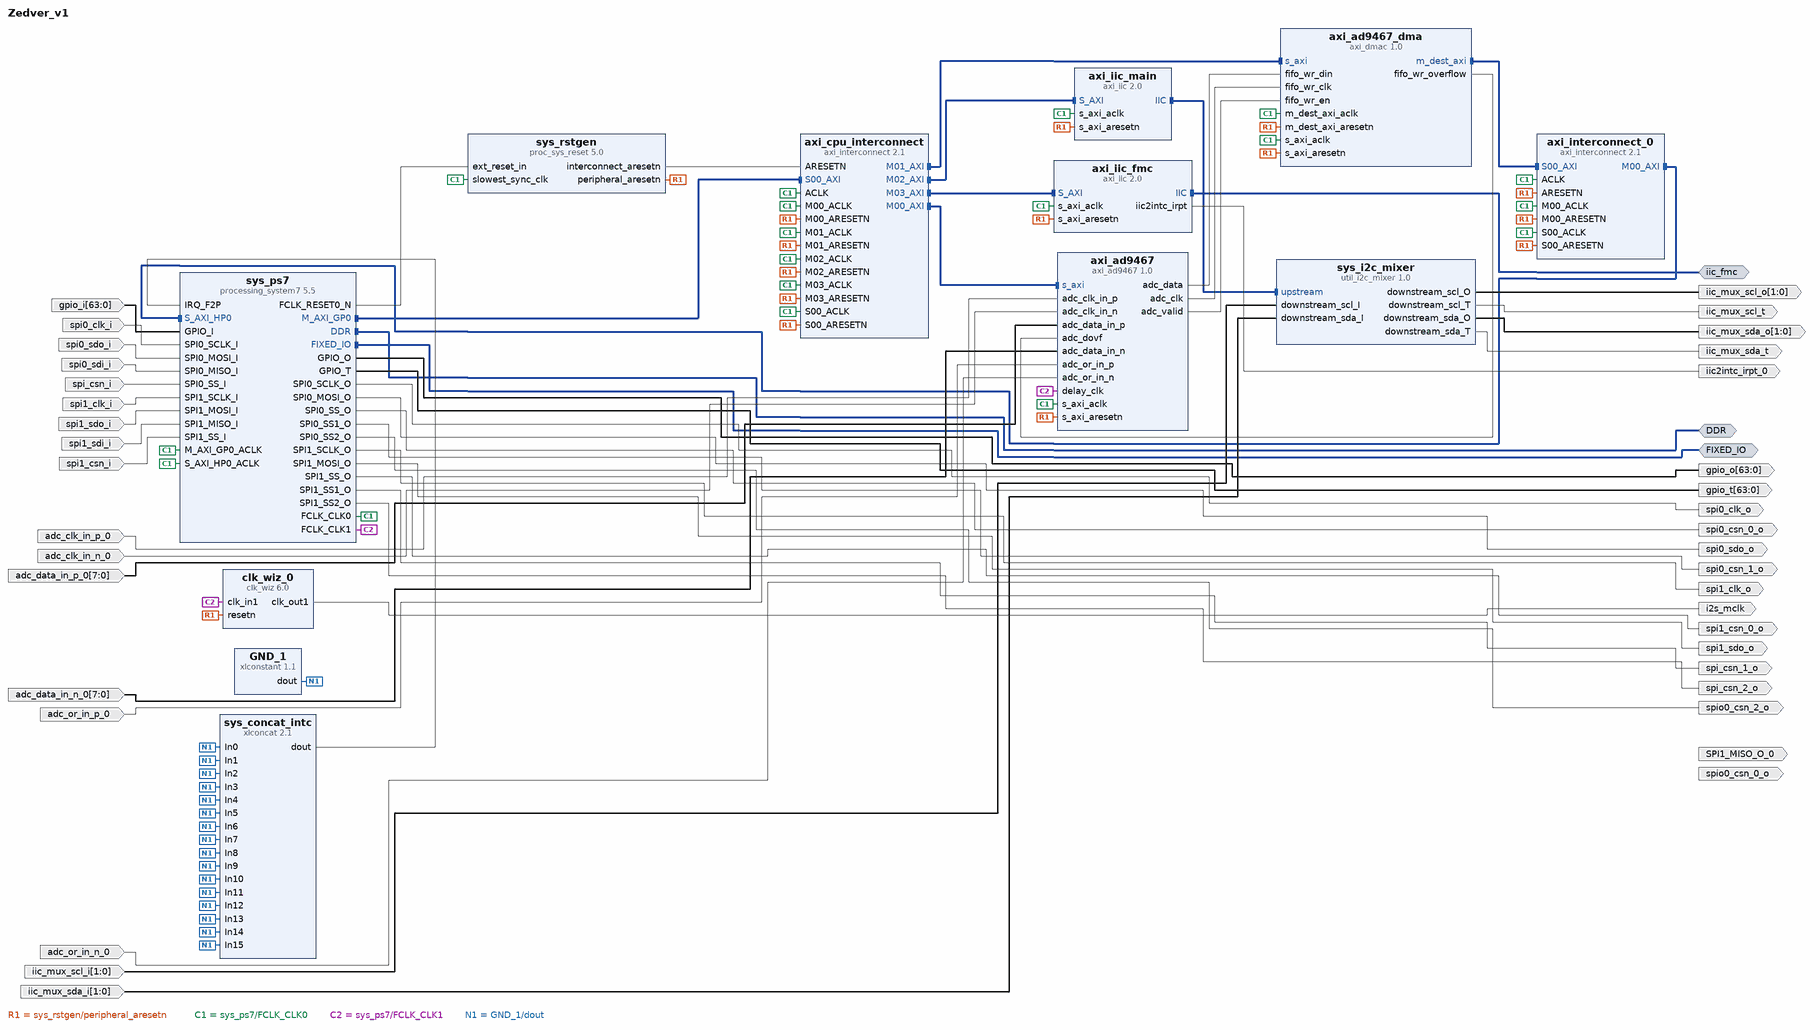
[diagram p0: block diagram of the top level]
# Vivado block design Zedver_v1, xc7z020clg484-1, Vivado 2018.2
create_bd_design Zedver_v1

create_bd_intf_port -mode Master -vlnv xilinx.com:interface:ddrx_rtl:1.0 DDR
create_bd_intf_port -mode Master -vlnv xilinx.com:display_processing_system7:fixedio_rtl:1.0 FIXED_IO
create_bd_intf_port -mode Master -vlnv xilinx.com:interface:iic_rtl:1.0 iic_fmc
create_bd_port -dir O spio0_csn_0_o
create_bd_port -dir O SPI1_MISO_O_0
create_bd_port -dir I -from 63 -to 0 gpio_i
create_bd_port -dir O -from 63 -to 0 gpio_o
create_bd_port -dir O -from 63 -to 0 gpio_t
create_bd_port -dir I spi0_clk_i
create_bd_port -dir O spi0_clk_o
create_bd_port -dir I spi0_sdo_i
create_bd_port -dir O spi0_sdo_o
create_bd_port -dir I spi0_sdi_i
create_bd_port -dir I spi_csn_i
create_bd_port -dir O spi0_csn_0_o
create_bd_port -dir O spi0_csn_1_o
create_bd_port -dir O spio0_csn_2_o
create_bd_port -dir I spi1_clk_i
create_bd_port -dir O spi1_clk_o
create_bd_port -dir I spi1_sdo_i
create_bd_port -dir O spi1_sdo_o
create_bd_port -dir I spi1_sdi_i
create_bd_port -dir I spi1_csn_i
create_bd_port -dir O spi1_csn_0_o
create_bd_port -dir O spi_csn_1_o
create_bd_port -dir O spi_csn_2_o
create_bd_port -dir I -type clk adc_clk_in_p_0
create_bd_port -dir I -type clk adc_clk_in_n_0
create_bd_port -dir I -from 7 -to 0 adc_data_in_p_0
create_bd_port -dir I -from 7 -to 0 adc_data_in_n_0
create_bd_port -dir I adc_or_in_p_0
create_bd_port -dir I adc_or_in_n_0
create_bd_port -dir O -type clk i2s_mclk
create_bd_port -dir I -from 1 -to 0 iic_mux_scl_i
create_bd_port -dir O -from 1 -to 0 iic_mux_scl_o
create_bd_port -dir O iic_mux_scl_t
create_bd_port -dir I -from 1 -to 0 iic_mux_sda_i
create_bd_port -dir O -from 1 -to 0 iic_mux_sda_o
create_bd_port -dir O iic_mux_sda_t
create_bd_port -dir O -type intr iic2intc_irpt_0

create_bd_cell -type ip -vlnv analog.com:user:axi_ad9467:1.0 axi_ad9467
create_bd_cell -type ip -vlnv analog.com:user:axi_dmac:1.0 axi_ad9467_dma
set_property -dict {CONFIG.DMA_DATA_WIDTH_SRC 16 CONFIG.DMA_AXI_PROTOCOL_DEST 1} [get_bd_cells axi_ad9467_dma]
create_bd_cell -type ip -vlnv xilinx.com:ip:processing_system7:5.5 sys_ps7
set_property -dict [list \
  CONFIG.PCW_FCLK_CLK1_BUF TRUE \
  CONFIG.PCW_UIPARAM_DDR_FREQ_MHZ 533.333313 \
  CONFIG.PCW_APU_PERIPHERAL_FREQMHZ 666.666667 \
  CONFIG.PCW_SDIO_PERIPHERAL_FREQMHZ 50 \
  CONFIG.PCW_UART_PERIPHERAL_FREQMHZ 50 \
  CONFIG.PCW_FPGA0_PERIPHERAL_FREQMHZ 100.000000 \
  CONFIG.PCW_FPGA1_PERIPHERAL_FREQMHZ 200 \
  CONFIG.PCW_USE_S_AXI_HP0 1 \
  CONFIG.PCW_USE_FABRIC_INTERRUPT 1 \
  CONFIG.PCW_EN_CLK1_PORT 1 \
  CONFIG.PCW_IRQ_F2P_INTR 1 \
  CONFIG.PCW_PRESET_BANK1_VOLTAGE {LVCMOS 1.8V} \
  CONFIG.PCW_UIPARAM_DDR_PARTNO {MT41J128M16 HA-15E} \
  CONFIG.PCW_QSPI_PERIPHERAL_ENABLE 1 \
  CONFIG.PCW_QSPI_QSPI_IO {MIO 1 .. 6} \
  CONFIG.PCW_QSPI_GRP_SINGLE_SS_ENABLE 1 \
  CONFIG.PCW_QSPI_GRP_SINGLE_SS_IO {MIO 1 .. 6} \
  CONFIG.PCW_SINGLE_QSPI_DATA_MODE x4 \
  CONFIG.PCW_ENET0_PERIPHERAL_ENABLE 1 \
  CONFIG.PCW_ENET0_ENET0_IO {MIO 16 .. 27} \
  CONFIG.PCW_ENET0_GRP_MDIO_ENABLE 1 \
  CONFIG.PCW_ENET0_GRP_MDIO_IO {MIO 52 .. 53} \
  CONFIG.PCW_ENET_RESET_ENABLE 1 \
  CONFIG.PCW_ENET_RESET_SELECT {Share reset pin} \
  CONFIG.PCW_ENET0_RESET_ENABLE 0 \
  CONFIG.PCW_SD0_PERIPHERAL_ENABLE 1 \
  CONFIG.PCW_SD0_SD0_IO {MIO 40 .. 45} \
  CONFIG.PCW_SD0_GRP_CD_ENABLE 1 \
  CONFIG.PCW_SD0_GRP_CD_IO {MIO 47} \
  CONFIG.PCW_SD0_GRP_WP_ENABLE 1 \
  CONFIG.PCW_SD0_GRP_WP_IO {MIO 46} \
  CONFIG.PCW_UART1_PERIPHERAL_ENABLE 1 \
  CONFIG.PCW_UART1_UART1_IO {MIO 48 .. 49} \
  CONFIG.PCW_SPI0_PERIPHERAL_ENABLE 1 \
  CONFIG.PCW_SPI0_SPI0_IO EMIO \
  CONFIG.PCW_SPI1_PERIPHERAL_ENABLE 1 \
  CONFIG.PCW_SPI1_SPI1_IO EMIO \
  CONFIG.PCW_USB0_PERIPHERAL_ENABLE 1 \
  CONFIG.PCW_USB0_USB0_IO {MIO 28 .. 39} \
  CONFIG.PCW_USB_RESET_ENABLE 1 \
  CONFIG.PCW_USB_RESET_SELECT {Share reset pin} \
  CONFIG.PCW_USB0_RESET_ENABLE 0 \
  CONFIG.PCW_I2C_RESET_ENABLE 1 \
  CONFIG.PCW_GPIO_MIO_GPIO_ENABLE 1 \
  CONFIG.PCW_GPIO_MIO_GPIO_IO MIO \
  CONFIG.PCW_GPIO_EMIO_GPIO_ENABLE 1 \
  CONFIG.PCW_GPIO_EMIO_GPIO_IO 64 \
  CONFIG.preset ZedBoard \
  CONFIG.PCW_FPGA_FCLK1_ENABLE 1 \
] [get_bd_cells sys_ps7]
# 231 more settings of sys_ps7 are not shown: defaults, MIO pin electricals, DDR timing, and values the tool derives
create_bd_cell -type ip -vlnv xilinx.com:ip:proc_sys_reset:5.0 sys_rstgen
create_bd_cell -type ip -vlnv xilinx.com:ip:clk_wiz:6.0 clk_wiz_0
set_property -dict [list \
  CONFIG.CLKOUT1_REQUESTED_OUT_FREQ 12.288 \
  CONFIG.USE_LOCKED false \
  CONFIG.RESET_PORT resetn \
  CONFIG.MMCM_DIVCLK_DIVIDE 9 \
  CONFIG.MMCM_CLKFBOUT_MULT_F 44.375 \
  CONFIG.MMCM_CLKOUT0_DIVIDE_F 80.250 \
  CONFIG.RESET_TYPE ACTIVE_LOW \
  CONFIG.CLKOUT1_JITTER 327.996 \
  CONFIG.CLKOUT1_PHASE_ERROR 264.435 \
] [get_bd_cells clk_wiz_0]
create_bd_cell -type ip -vlnv xilinx.com:ip:xlconcat:2.1 sys_concat_intc
set_property -dict {CONFIG.NUM_PORTS 16} [get_bd_cells sys_concat_intc]
create_bd_cell -type ip -vlnv xilinx.com:ip:xlconstant:1.1 GND_1
set_property -dict {CONFIG.CONST_VAL 0} [get_bd_cells GND_1]
create_bd_cell -type ip -vlnv xilinx.com:ip:axi_interconnect:2.1 axi_cpu_interconnect
set_property -dict {CONFIG.NUM_MI 4} [get_bd_cells axi_cpu_interconnect]
create_bd_cell -type ip -vlnv xilinx.com:ip:axi_iic:2.0 axi_iic_main
create_bd_cell -type ip -vlnv analog.com:user:util_i2c_mixer:1.0 sys_i2c_mixer
create_bd_cell -type ip -vlnv xilinx.com:ip:axi_iic:2.0 axi_iic_fmc
create_bd_cell -type ip -vlnv xilinx.com:ip:axi_interconnect:2.1 axi_interconnect_0
set_property -dict {CONFIG.NUM_MI 1} [get_bd_cells axi_interconnect_0]

# ---- connections ----

connect_bd_intf_net -intf_net processing_system7_0_M_AXI_GP0 [get_bd_intf_pins sys_ps7/M_AXI_GP0] [get_bd_intf_pins axi_cpu_interconnect/S00_AXI]
connect_bd_intf_net [get_bd_intf_pins axi_cpu_interconnect/M00_AXI] [get_bd_intf_pins axi_ad9467/s_axi]
connect_bd_intf_net [get_bd_intf_pins axi_cpu_interconnect/M01_AXI] [get_bd_intf_pins axi_ad9467_dma/s_axi]
connect_bd_intf_net [get_bd_intf_pins axi_cpu_interconnect/M02_AXI] [get_bd_intf_pins axi_iic_main/S_AXI]
connect_bd_intf_net -intf_net axi_iic_0_IIC [get_bd_intf_pins axi_iic_main/IIC] [get_bd_intf_pins sys_i2c_mixer/upstream]
connect_bd_intf_net [get_bd_intf_pins axi_cpu_interconnect/M03_AXI] [get_bd_intf_pins axi_iic_fmc/S_AXI]
connect_bd_intf_net [get_bd_intf_pins axi_interconnect_0/M00_AXI] [get_bd_intf_pins sys_ps7/S_AXI_HP0]
connect_bd_intf_net -intf_net axi_dmac_m_dest_axi [get_bd_intf_pins axi_ad9467_dma/m_dest_axi] [get_bd_intf_pins axi_interconnect_0/S00_AXI]
connect_bd_intf_net -intf_net processing_system7_0_DDR [get_bd_intf_ports DDR] [get_bd_intf_pins sys_ps7/DDR]
connect_bd_intf_net -intf_net processing_system7_0_FIXED_IO [get_bd_intf_ports FIXED_IO] [get_bd_intf_pins sys_ps7/FIXED_IO]
connect_bd_intf_net -intf_net axi_iic_1_IIC [get_bd_intf_ports iic_fmc] [get_bd_intf_pins axi_iic_fmc/IIC]
connect_bd_net -net axi_ad9467_0_adc_data [get_bd_pins axi_ad9467/adc_data] [get_bd_pins axi_ad9467_dma/fifo_wr_din]
connect_bd_net -net axi_ad9467_0_adc_clk [get_bd_pins axi_ad9467/adc_clk] [get_bd_pins axi_ad9467_dma/fifo_wr_clk]
connect_bd_net -net axi_ad9467_0_adc_valid [get_bd_pins axi_ad9467/adc_valid] [get_bd_pins axi_ad9467_dma/fifo_wr_en]
connect_bd_net -net processing_system7_0_FCLK_RESET0_N [get_bd_pins sys_ps7/FCLK_RESET0_N] [get_bd_pins sys_rstgen/ext_reset_in]
connect_bd_net -net rst_ps7_0_100M_peripheral_aresetn [get_bd_pins sys_rstgen/peripheral_aresetn] \
  [get_bd_pins axi_ad9467_dma/m_dest_axi_aresetn] [get_bd_pins axi_ad9467/s_axi_aresetn] \
  [get_bd_pins axi_ad9467_dma/s_axi_aresetn] [get_bd_pins clk_wiz_0/resetn] [get_bd_pins axi_iic_main/s_axi_aresetn] \
  [get_bd_pins axi_iic_fmc/s_axi_aresetn] [get_bd_pins axi_cpu_interconnect/M00_ARESETN] \
  [get_bd_pins axi_cpu_interconnect/S00_ARESETN] [get_bd_pins axi_cpu_interconnect/M01_ARESETN] \
  [get_bd_pins axi_cpu_interconnect/M02_ARESETN] [get_bd_pins axi_cpu_interconnect/M03_ARESETN] \
  [get_bd_pins axi_interconnect_0/M00_ARESETN] [get_bd_pins axi_interconnect_0/S00_ARESETN] \
  [get_bd_pins axi_interconnect_0/ARESETN]
connect_bd_net -net GPIO_I_0_1 [get_bd_ports gpio_i] [get_bd_pins sys_ps7/GPIO_I]
connect_bd_net -net processing_system7_0_GPIO_O [get_bd_pins sys_ps7/GPIO_O] [get_bd_ports gpio_o]
connect_bd_net -net processing_system7_0_GPIO_T [get_bd_pins sys_ps7/GPIO_T] [get_bd_ports gpio_t]
connect_bd_net -net SPI0_SCLK_I_0_1 [get_bd_ports spi0_clk_i] [get_bd_pins sys_ps7/SPI0_SCLK_I]
connect_bd_net -net processing_system7_0_SPI0_SCLK_O [get_bd_pins sys_ps7/SPI0_SCLK_O] [get_bd_ports spi0_clk_o]
connect_bd_net -net SPI0_MOSI_I_0_1 [get_bd_ports spi0_sdo_i] [get_bd_pins sys_ps7/SPI0_MOSI_I]
connect_bd_net -net processing_system7_0_SPI0_MOSI_O [get_bd_pins sys_ps7/SPI0_MOSI_O] [get_bd_ports spi0_sdo_o]
connect_bd_net -net SPI0_MISO_I_0_1 [get_bd_ports spi0_sdi_i] [get_bd_pins sys_ps7/SPI0_MISO_I]
connect_bd_net -net SPI0_SS_I_0_1 [get_bd_ports spi_csn_i] [get_bd_pins sys_ps7/SPI0_SS_I]
connect_bd_net -net processing_system7_0_SPI0_SS_O [get_bd_pins sys_ps7/SPI0_SS_O] [get_bd_ports spi0_csn_0_o]
connect_bd_net -net processing_system7_0_SPI0_SS1_O [get_bd_pins sys_ps7/SPI0_SS1_O] [get_bd_ports spi0_csn_1_o]
connect_bd_net -net processing_system7_0_SPI0_SS2_O [get_bd_pins sys_ps7/SPI0_SS2_O] [get_bd_ports spio0_csn_2_o]
connect_bd_net -net SPI1_SCLK_I_0_1 [get_bd_ports spi1_clk_i] [get_bd_pins sys_ps7/SPI1_SCLK_I]
connect_bd_net -net processing_system7_0_SPI1_SCLK_O [get_bd_pins sys_ps7/SPI1_SCLK_O] [get_bd_ports spi1_clk_o]
connect_bd_net -net SPI1_MOSI_I_0_1 [get_bd_ports spi1_sdo_i] [get_bd_pins sys_ps7/SPI1_MOSI_I]
connect_bd_net -net processing_system7_0_SPI1_MOSI_O [get_bd_pins sys_ps7/SPI1_MOSI_O] [get_bd_ports spi1_sdo_o]
connect_bd_net -net SPI1_MISO_I_0_1 [get_bd_ports spi1_sdi_i] [get_bd_pins sys_ps7/SPI1_MISO_I]
connect_bd_net -net SPI1_SS_I_0_1 [get_bd_ports spi1_csn_i] [get_bd_pins sys_ps7/SPI1_SS_I]
connect_bd_net -net processing_system7_0_SPI1_SS_O [get_bd_pins sys_ps7/SPI1_SS_O] [get_bd_ports spi1_csn_0_o]
connect_bd_net -net processing_system7_0_SPI1_SS1_O [get_bd_pins sys_ps7/SPI1_SS1_O] [get_bd_ports spi_csn_1_o]
connect_bd_net -net processing_system7_0_SPI1_SS2_O [get_bd_pins sys_ps7/SPI1_SS2_O] [get_bd_ports spi_csn_2_o]
connect_bd_net -net adc_clk_in_p_0_1 [get_bd_ports adc_clk_in_p_0] [get_bd_pins axi_ad9467/adc_clk_in_p]
connect_bd_net -net adc_clk_in_n_0_1 [get_bd_ports adc_clk_in_n_0] [get_bd_pins axi_ad9467/adc_clk_in_n]
connect_bd_net -net adc_data_in_p_0_1 [get_bd_ports adc_data_in_p_0] [get_bd_pins axi_ad9467/adc_data_in_p]
connect_bd_net -net adc_data_in_n_0_1 [get_bd_ports adc_data_in_n_0] [get_bd_pins axi_ad9467/adc_data_in_n]
connect_bd_net -net adc_or_in_p_0_1 [get_bd_ports adc_or_in_p_0] [get_bd_pins axi_ad9467/adc_or_in_p]
connect_bd_net -net adc_or_in_n_0_1 [get_bd_ports adc_or_in_n_0] [get_bd_pins axi_ad9467/adc_or_in_n]
connect_bd_net -net processing_system7_0_FCLK_CLK0 [get_bd_pins sys_ps7/FCLK_CLK0] \
  [get_bd_pins axi_ad9467_dma/m_dest_axi_aclk] [get_bd_pins sys_rstgen/slowest_sync_clk] [get_bd_pins sys_ps7/S_AXI_HP0_ACLK] \
  [get_bd_pins axi_ad9467/s_axi_aclk] [get_bd_pins sys_ps7/M_AXI_GP0_ACLK] [get_bd_pins axi_ad9467_dma/s_axi_aclk] \
  [get_bd_pins axi_iic_main/s_axi_aclk] [get_bd_pins axi_iic_fmc/s_axi_aclk] [get_bd_pins axi_cpu_interconnect/M00_ACLK] \
  [get_bd_pins axi_cpu_interconnect/S00_ACLK] [get_bd_pins axi_cpu_interconnect/ACLK] \
  [get_bd_pins axi_cpu_interconnect/M01_ACLK] [get_bd_pins axi_cpu_interconnect/M02_ACLK] \
  [get_bd_pins axi_cpu_interconnect/M03_ACLK] [get_bd_pins axi_interconnect_0/S00_ACLK] \
  [get_bd_pins axi_interconnect_0/M00_ACLK] [get_bd_pins axi_interconnect_0/ACLK]
connect_bd_net -net processing_system7_0_FCLK_CLK1 [get_bd_pins sys_ps7/FCLK_CLK1] [get_bd_pins axi_ad9467/delay_clk] [get_bd_pins clk_wiz_0/clk_in1]
connect_bd_net [get_bd_pins clk_wiz_0/clk_out1] [get_bd_ports i2s_mclk]
connect_bd_net -net axi_dmac_0_fifo_wr_overflow [get_bd_pins axi_ad9467_dma/fifo_wr_overflow] [get_bd_pins axi_ad9467/adc_dovf]
connect_bd_net -net xlconstant_0_dout [get_bd_pins GND_1/dout] \
  [get_bd_pins sys_concat_intc/In0] [get_bd_pins sys_concat_intc/In1] [get_bd_pins sys_concat_intc/In2] \
  [get_bd_pins sys_concat_intc/In3] [get_bd_pins sys_concat_intc/In4] [get_bd_pins sys_concat_intc/In5] \
  [get_bd_pins sys_concat_intc/In6] [get_bd_pins sys_concat_intc/In7] [get_bd_pins sys_concat_intc/In8] \
  [get_bd_pins sys_concat_intc/In9] [get_bd_pins sys_concat_intc/In10] [get_bd_pins sys_concat_intc/In11] \
  [get_bd_pins sys_concat_intc/In12] [get_bd_pins sys_concat_intc/In13] [get_bd_pins sys_concat_intc/In14] \
  [get_bd_pins sys_concat_intc/In15]
connect_bd_net -net xlconcat_0_dout [get_bd_pins sys_concat_intc/dout] [get_bd_pins sys_ps7/IRQ_F2P]
connect_bd_net -net rst_ps7_0_100M_interconnect_aresetn [get_bd_pins sys_rstgen/interconnect_aresetn] [get_bd_pins axi_cpu_interconnect/ARESETN]
connect_bd_net -net downstream_scl_I_0_1 [get_bd_ports iic_mux_scl_i] [get_bd_pins sys_i2c_mixer/downstream_scl_I]
connect_bd_net -net util_i2c_mixer_0_downstream_scl_O [get_bd_pins sys_i2c_mixer/downstream_scl_O] [get_bd_ports iic_mux_scl_o]
connect_bd_net -net util_i2c_mixer_0_downstream_scl_T [get_bd_pins sys_i2c_mixer/downstream_scl_T] [get_bd_ports iic_mux_scl_t]
connect_bd_net -net downstream_sda_I_0_1 [get_bd_ports iic_mux_sda_i] [get_bd_pins sys_i2c_mixer/downstream_sda_I]
connect_bd_net -net util_i2c_mixer_0_downstream_sda_O [get_bd_pins sys_i2c_mixer/downstream_sda_O] [get_bd_ports iic_mux_sda_o]
connect_bd_net -net util_i2c_mixer_0_downstream_sda_T [get_bd_pins sys_i2c_mixer/downstream_sda_T] [get_bd_ports iic_mux_sda_t]
connect_bd_net -net axi_iic_1_iic2intc_irpt [get_bd_pins axi_iic_fmc/iic2intc_irpt] [get_bd_ports iic2intc_irpt_0]

# ---- address map ----
assign_bd_address -offset 0x00000000 -range 512M -target_address_space [get_bd_addr_spaces axi_ad9467_dma/m_dest_axi] [get_bd_addr_segs sys_ps7/S_AXI_HP0/HP0_DDR_LOWOCM]
assign_bd_address -offset 0x41600000 -range 4K -target_address_space [get_bd_addr_spaces sys_ps7/Data] [get_bd_addr_segs axi_iic_main/S_AXI/Reg]
assign_bd_address -offset 0x41620000 -range 4K -target_address_space [get_bd_addr_spaces sys_ps7/Data] [get_bd_addr_segs axi_iic_fmc/S_AXI/Reg]
assign_bd_address -offset 0x44A00000 -range 64K -target_address_space [get_bd_addr_spaces sys_ps7/Data] [get_bd_addr_segs axi_ad9467/s_axi/axi_lite]
assign_bd_address -offset 0x44A30000 -range 4K -target_address_space [get_bd_addr_spaces sys_ps7/Data] [get_bd_addr_segs axi_ad9467_dma/s_axi/axi_lite]

validate_bd_design
save_bd_design
